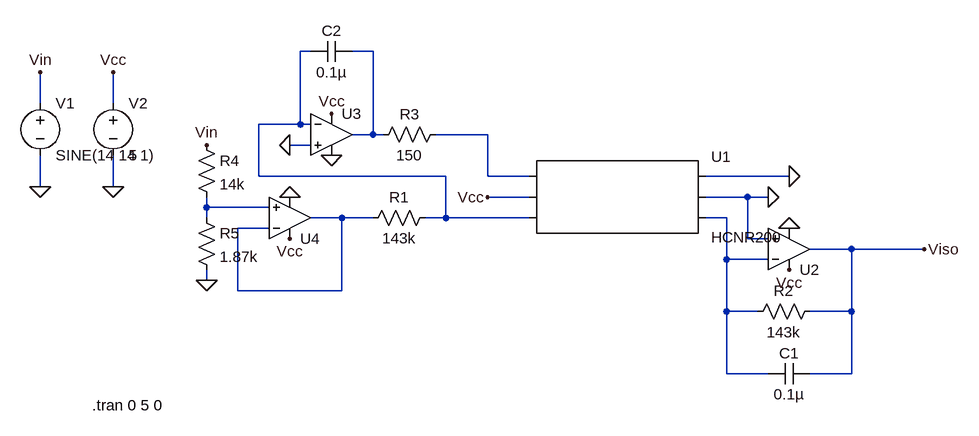
[diagram p0: schematic linear_opto_sensing.asc]
linear_opto_sensing.asc, the LTspice schematic file:
Version 4
SHEET 1 880 680
WIRE -432 -128 -448 -128
WIRE -336 -128 -368 -128
WIRE -848 -48 -848 -96
WIRE -736 -48 -736 -96
WIRE -448 -16 -448 -128
WIRE -448 -16 -512 -16
WIRE -432 -16 -448 -16
WIRE -336 0 -336 -128
WIRE -336 0 -368 0
WIRE -320 0 -336 0
WIRE -160 0 -240 0
WIRE -432 16 -464 16
WIRE -512 64 -512 -16
WIRE -224 64 -512 64
WIRE -160 64 -160 0
WIRE -96 64 -160 64
WIRE 304 64 176 64
WIRE -848 80 -848 32
WIRE -736 80 -736 32
WIRE -96 96 -160 96
WIRE 240 96 176 96
WIRE 272 96 240 96
WIRE -592 112 -592 96
WIRE -496 112 -592 112
WIRE -592 128 -592 112
WIRE -384 128 -432 128
WIRE -336 128 -384 128
WIRE -224 128 -224 64
WIRE -224 128 -256 128
WIRE -96 128 -224 128
WIRE 208 128 176 128
WIRE -496 144 -544 144
WIRE 240 160 240 96
WIRE 272 160 240 160
WIRE 400 176 336 176
WIRE 512 176 400 176
WIRE 208 192 208 128
WIRE 272 192 208 192
WIRE -592 224 -592 208
WIRE -544 240 -544 144
WIRE -384 240 -384 128
WIRE -384 240 -544 240
WIRE 208 272 208 192
WIRE 256 272 208 272
WIRE 400 272 400 176
WIRE 400 272 336 272
WIRE 208 368 208 272
WIRE 272 368 208 368
WIRE 400 368 400 272
WIRE 400 368 336 368
FLAG 304 64 0
FLAG -160 96 Vcc
FLAG -736 80 0
FLAG -736 -96 Vcc
FLAG -464 16 0
FLAG 512 176 Viso
FLAG -400 -32 Vcc
FLAG 304 208 Vcc
FLAG -400 32 0
FLAG 304 144 0
FLAG 272 96 0
FLAG -464 96 0
FLAG -464 160 Vcc
FLAG -592 224 0
FLAG -848 80 0
FLAG -848 -96 Vin
FLAG -592 16 Vin
SYMBOL AutoGenerated\\HCNR200 -64 96 R0
SYMATTR InstName U1
SYMBOL res -240 112 R90
WINDOW 0 0 56 VBottom 2
WINDOW 3 32 56 VTop 2
SYMATTR InstName R1
SYMATTR Value 143k
SYMBOL res 352 256 R90
WINDOW 0 0 56 VBottom 2
WINDOW 3 32 56 VTop 2
SYMATTR InstName R2
SYMATTR Value 143k
SYMBOL voltage -736 -64 R0
WINDOW 123 0 0 Left 0
WINDOW 39 0 0 Left 0
SYMATTR InstName V2
SYMATTR Value 5
SYMBOL res -224 -16 R90
WINDOW 0 0 56 VBottom 2
WINDOW 3 32 56 VTop 2
SYMATTR InstName R3
SYMATTR Value 150
SYMBOL OpAmps\\UniversalOpAmp2 304 176 M180
SYMATTR InstName U2
SYMBOL OpAmps\\UniversalOpAmp2 -400 0 R0
SYMATTR InstName U3
SYMBOL OpAmps\\UniversalOpAmp2 -464 128 M180
SYMATTR InstName U4
SYMBOL res -608 0 R0
SYMATTR InstName R4
SYMATTR Value 14k
SYMBOL res -608 112 R0
SYMATTR InstName R5
SYMATTR Value 1.87k
SYMBOL voltage -848 -64 R0
WINDOW 123 0 0 Left 0
WINDOW 39 0 0 Left 0
SYMATTR InstName V1
SYMATTR Value SINE(14 14 1)
SYMBOL cap 336 352 R90
WINDOW 0 0 32 VBottom 2
WINDOW 3 32 32 VTop 2
SYMATTR InstName C1
SYMATTR Value 0.1µ
SYMBOL cap -368 -144 R90
WINDOW 0 0 32 VBottom 2
WINDOW 3 32 32 VTop 2
SYMATTR InstName C2
SYMATTR Value 0.1µ
TEXT -768 416 Left 2 !.tran 0 5 0

The netlist it stands for:
* linear_opto_sensing.asc
* U1: HCNR200 (symbol AutoGenerated\HCNR200 not available, pins judged from their places): pin1=N003 pin2=Vcc pin3=N001 pin4=0 pin5=0 pin6=N006
R1 N001 N005 143k
R2 Viso N006 143k
V2 Vcc 0 5
R3 N003 N002 150
XU2 0 N006 Vcc 0 Viso level2 Avol=1Meg GBW=10Meg Slew=10Meg Ilimit=25m Rail=0 Vos=0 En=0 Enk=0 In=0 Ink=0 Rin=500Meg  ; pins In+ In- V+ V- OUT
XU3 0 N001 Vcc 0 N002 level2 Avol=1Meg GBW=10Meg Slew=10Meg Ilimit=25m Rail=0 Vos=0 En=0 Enk=0 In=0 Ink=0 Rin=500Meg  ; pins In+ In- V+ V- OUT
XU4 N004 N005 Vcc 0 N005 level2 Avol=1Meg GBW=10Meg Slew=10Meg Ilimit=25m Rail=0 Vos=0 En=0 Enk=0 In=0 Ink=0 Rin=500Meg  ; pins In+ In- V+ V- OUT
R4 Vin N004 14k
R5 N004 0 1.87k
V1 Vin 0 SINE(14 14 1)
C1 Viso N006 0.1µ
C2 N002 N001 0.1µ
.tran 0 5 0
.lib UniversalOpAmp2.lib
.backanno
.end